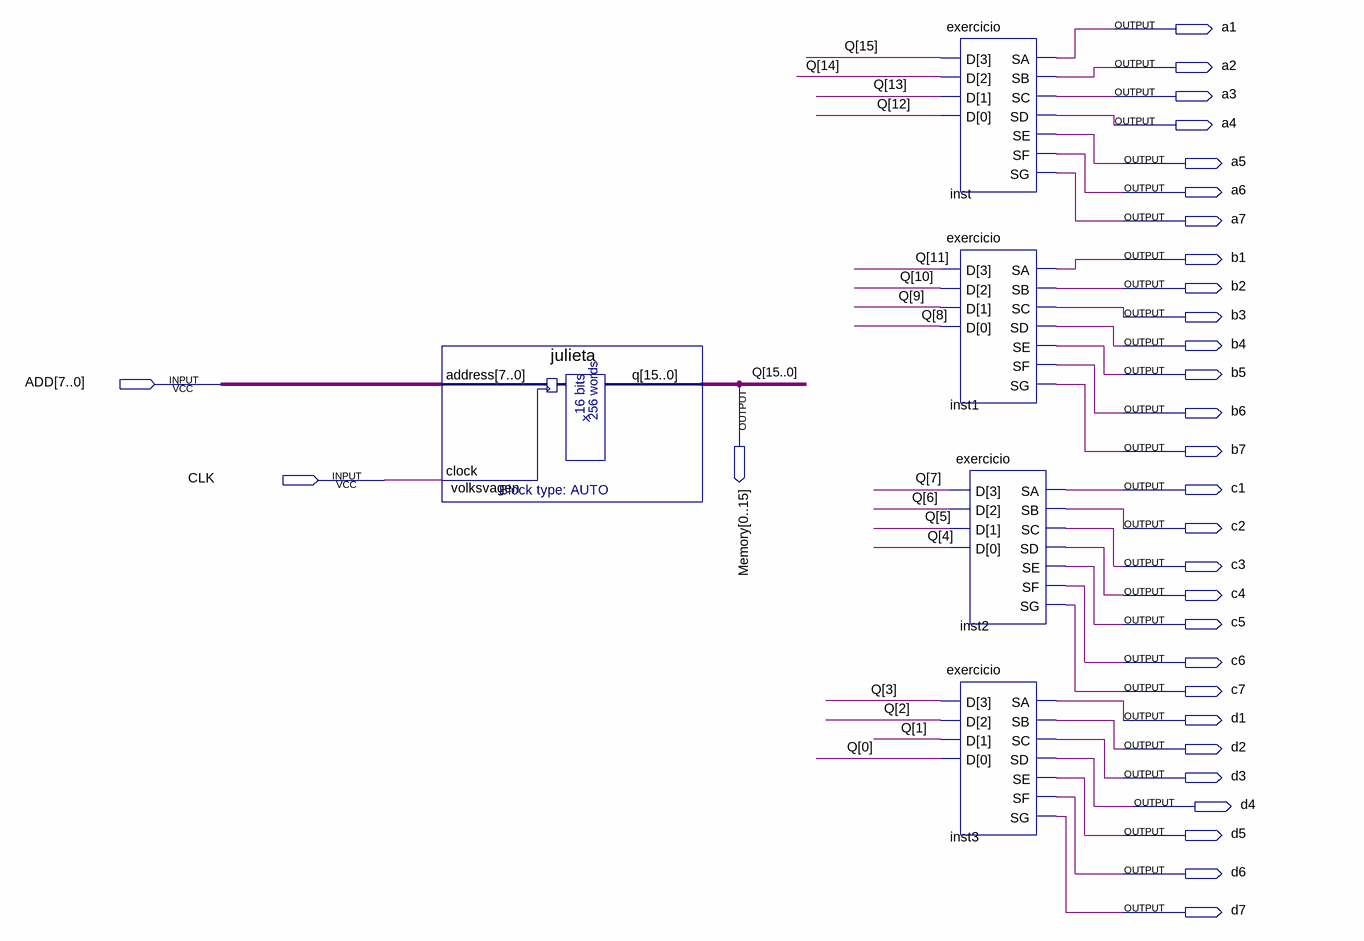
[diagram p0: schematic sheet]
// Quartus schematic ROM.bdf as structural Verilog: 5 symbols, 31 pins
module ROM (
  input  [7:0] ADD,
  input  CLK,
  output a1,
  output a2,
  output a3,
  output a4,
  output a5,
  output a6,
  output a7,
  output b1,
  output b2,
  output b3,
  output b4,
  output b5,
  output [0:15] Memory,
  output b6,
  output b7,
  output c1,
  output c2,
  output c3,
  output c4,
  output c5,
  output c6,
  output c7,
  output d1,
  output d2,
  output d3,
  output d4,
  output d5,
  output d6,
  output d7
);

  julieta volksvagen (.address(ADD), .clock(CLK), .q(Memory));
  exercicio inst (.D(Memory[0:3]), .SA(a1), .SB(a2), .SC(a3), .SD(a4), .SE(a5), .SF(a6), .SG(a7));
  exercicio inst1 (.D(Memory[4:7]), .SA(b1), .SB(b2), .SC(b3), .SD(b4), .SE(b5), .SF(b6), .SG(b7));
  exercicio inst2 (.D(Memory[8:11]), .SA(c1), .SB(c2), .SC(c3), .SD(c4), .SE(c5), .SF(c6), .SG(c7));
  exercicio inst3 (.D(Memory[12:15]), .SA(d1), .SB(d2), .SC(d3), .SD(d4), .SE(d5), .SF(d6), .SG(d7));

  // Other names for the same wires on the sheet: Q[15:0] = Memory
endmodule
